# EAGLE design naomi_io (EAGLE 6.5.0)
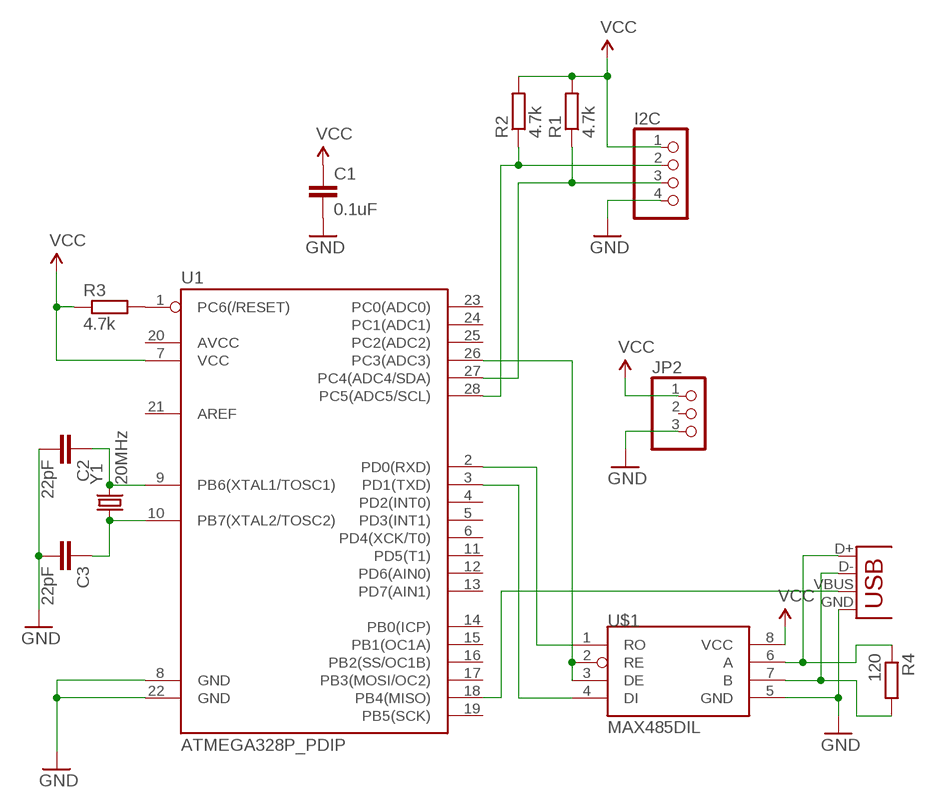
[diagram p0: schematic, sheet 1]

## Parts
C1  0.1uF  C-EU025-030X050  [C025-030X050]
C2  22pF  C-EU025-030X050  [C025-030X050]
C3  22pF  C-EU025-030X050  [C025-030X050]
I2C  PINHD-1X4/90  [1X04/90]
JP1  USB-B  USBPTH  [USB-B-PTH]
JP2  PINHD-1X3  [1X03]
R1  4.7k  R-EU_0204/5  [0204/5]
R2  4.7k  R-EU_0204/5  [0204/5]
R3  4.7k  R-EU_0204/5  [0204/5]
R4  120  R-EU_0204/5  [0204/5]
U1  ATMEGA328P_PDIP  [DIL28-3]
U$1  MAX485DIL  [DIL08]
Y1  20MHz  CRYSTALHC49US  [HC49US]

## Nets
GND: C1.2 C2.2 C3.2 I2C.4 JP1.GND JP2.3 U1.8(GND) U1.22(GND) U$1.5(GND)
N$1: I2C.2 R2.1 U1.28(PC5(ADC5/SCL))
N$2: I2C.3 R1.1 U1.27(PC4(ADC4/SDA))
N$3: R3.2 U1.1(PC6(/RESET))
N$5: JP1.D- R4.2 U$1.7(B)
N$6: U1.2(PD0(RXD)) U$1.1(RO)
N$7: U1.3(PD1(TXD)) U$1.4(DI)
N$8: JP1.VBUS U1.18(PB4(MISO))
N$9: U1.26(PC3(ADC3)) U$1.2(RE) U$1.3(DE)
N$10: C2.1 U1.9(PB6(XTAL1/TOSC1)) Y1.2
N$11: C3.1 U1.10(PB7(XTAL2/TOSC2)) Y1.1
N$12: JP1.D+ R4.1 U$1.6(A)
VCC: C1.1 I2C.1 JP2.1 R1.2 R2.2 R3.1 U1.7(VCC) U$1.8(VCC)
Unconnected: JP2.2 U1.4(PD2(INT0)) U1.5(PD3(INT1)) U1.6(PD4(XCK/T0)) U1.11(PD5(T1)) U1.12(PD6(AIN0)) U1.13(PD7(AIN1)) U1.14(PB0(ICP)) U1.15(PB1(OC1A)) U1.16(PB2(SS/OC1B)) U1.17(PB3(MOSI/OC2)) U1.19(PB5(SCK)) U1.20(AVCC) U1.21(AREF) U1.23(PC0(ADC0)) U1.24(PC1(ADC1)) U1.25(PC2(ADC2))

## Library data of the parts
C1-C3 = rcl:C-EU: CAPACITOR, European symbol
I2C = pinhead:PINHD-1X4: PIN HEADER
JP1 = SparkFun-Connectors:USB: USB Connectors USB-B-PTH is fully proven SKU : PRT-00139/CONN-08278 USB-miniB is fully proven SKU : PRT-00587 USB-A-PCB is untested. USB-A-H is throughly reviewed, but untested. Spark Fun Electronics SKU : PRT-00437 USB-B-SMT is throughly reviewed, but untested. Needs silkscreen touching up. USB-A-S has not been used/tested USB-MB-H has not been used/tested USB-MICROB has been used. CONN-09505; PROD_ID: CONN-08278
JP2 = pinhead:PINHD-1X3: PIN HEADER
R1-R4 = rcl:R-EU_: RESISTOR, European symbol
U1 = SparkFun-DigitalIC:ATMEGA328P_PDIP: uC used in the Arduino 32kb flash, 1k EEPROM, 2k SRAM This is the through-hole version of this chip.
U$1 = SparkFun-DigitalIC:MAX485: RS-485 transceiver
Y1 = SparkFun-FreqCtrl:CRYSTAL: Various standard crystals. Proven footprints. Spark Fun Electronics SKU : COM-00534

## Board
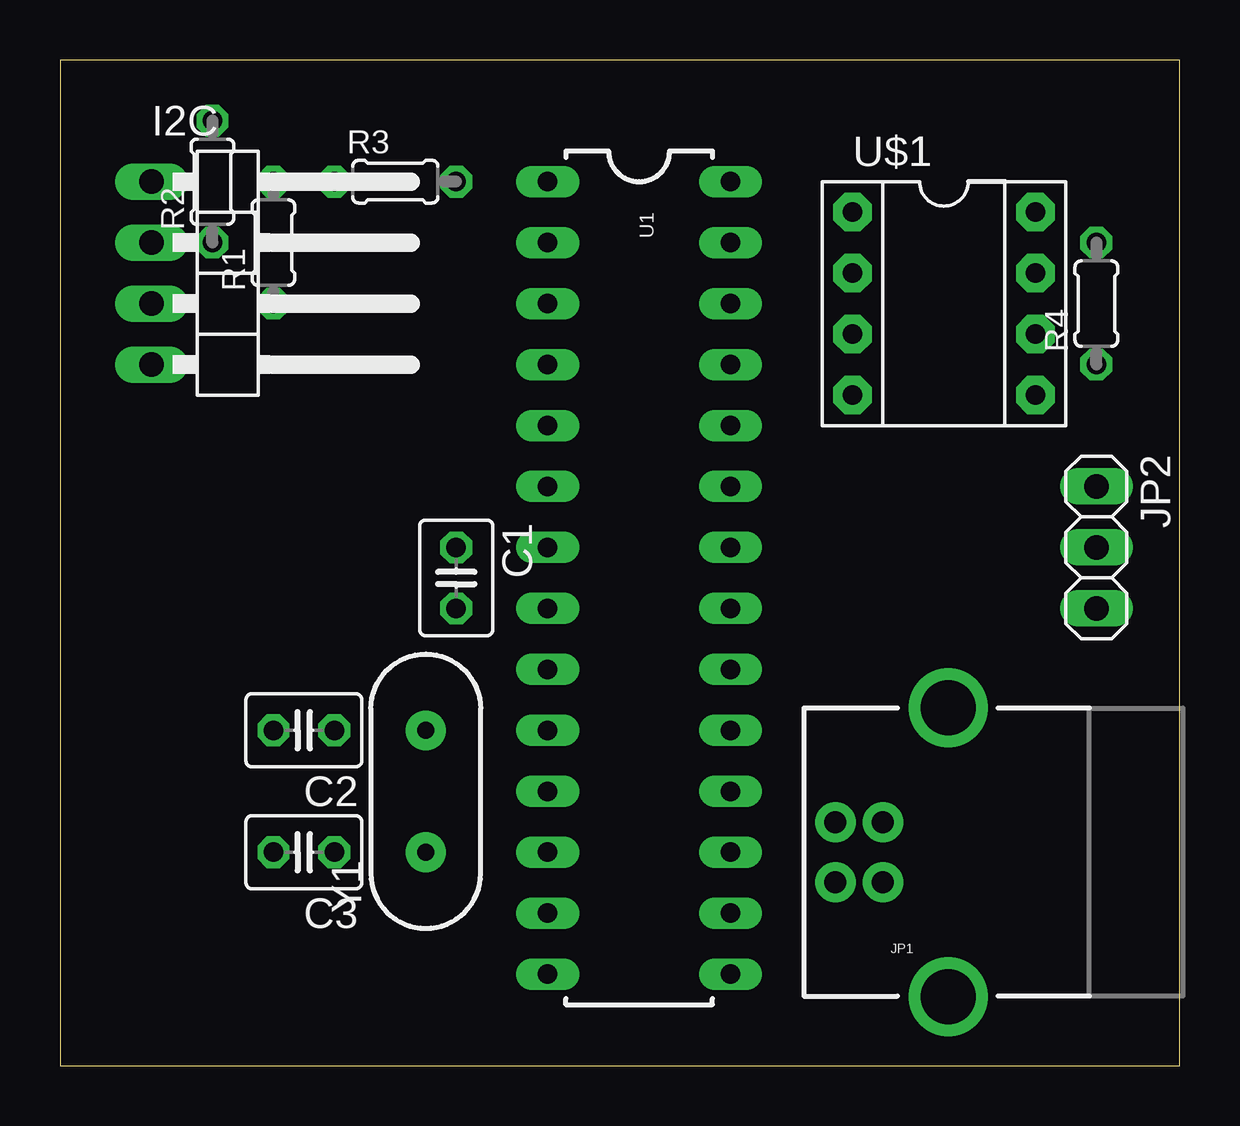
[diagram p1: board, top side]
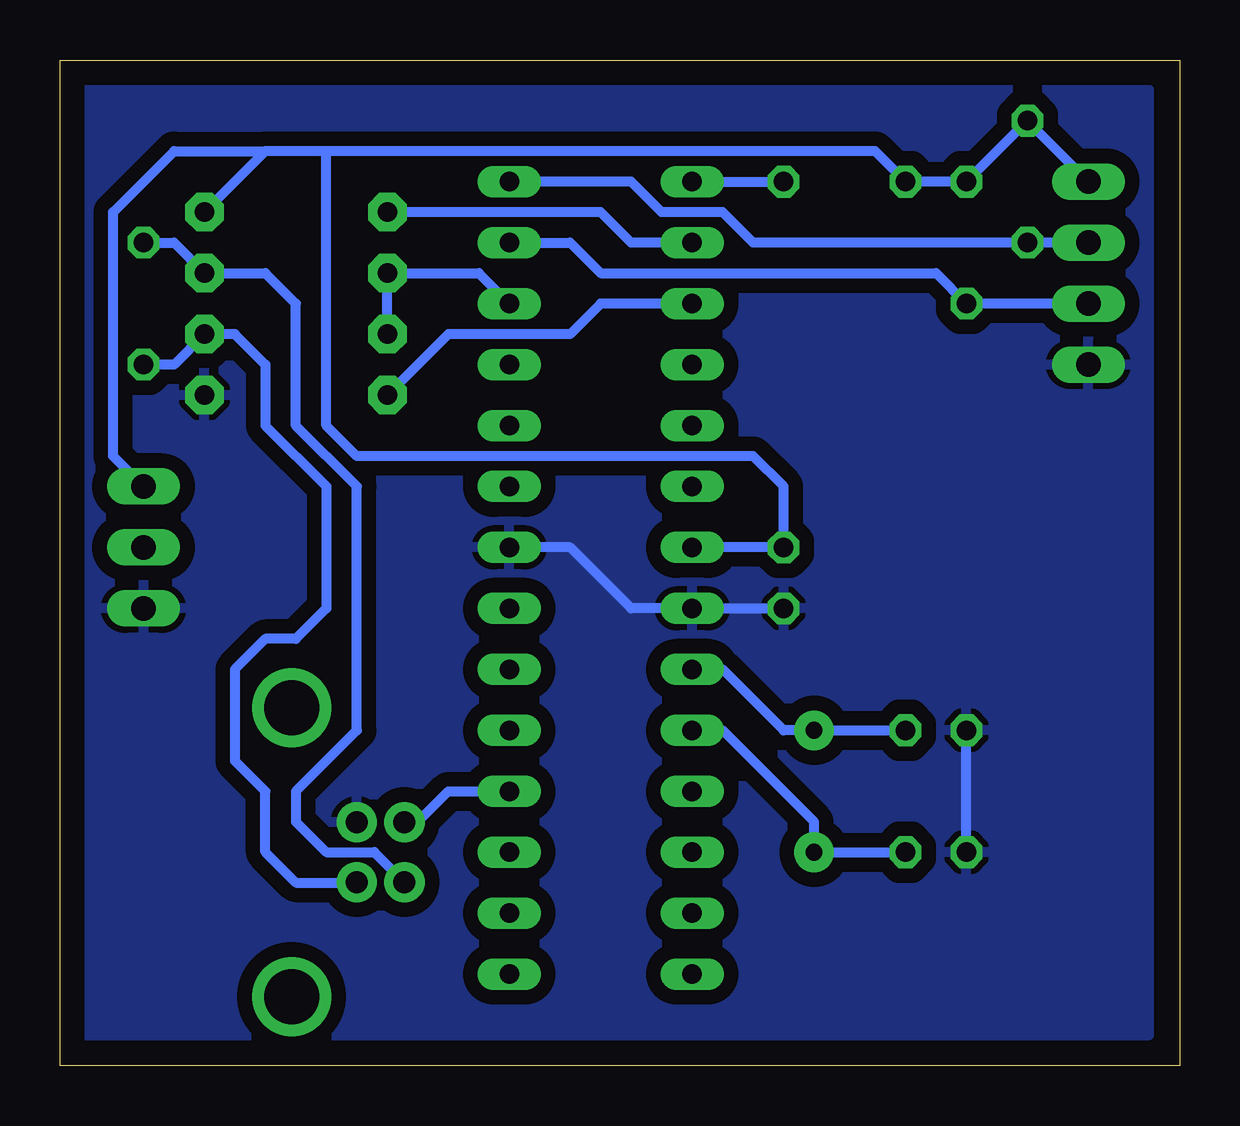
[diagram p2: board, bottom side, seen from below]

Size 46.66 x 41.9 mm. Coordinates in mm from the lower left corner, seen from the top.
Outline: 0,0 46.66,0 46.66,41.9 0,41.9 0,0
Copper layers (1*16): Top 0.035mm / dielectric 1.5mm / Bottom 0.035mm
Design rules "default": minimum track width 10mil, minimum drill 24mil, track to track 8mil, track to pad 8mil, pad to pad 8mil, via to via 8mil, smd to smd 8mil, copper to edge 40mil, drill to drill 8mil, minimum pad ring 10mil, minimum via ring 8mil, stop-mask expansion 4mil, vias tented up to drill 0mil, thermal gap 10mil

### Footprints (pad centres in the part's own frame; a part is rotated, then mirrored left to right if it is on the bottom)
C025-030X050 = drill 0.813 octagon: 1 -1.27,0; 2 1.27,0
1X04/90 = drill 1.016 long: 1 -3.81,-3.81; 2 -1.27,-3.81; 3 1.27,-3.81; 4 3.81,-3.81
USB-B-PTH = drill 0.914 pad 1.676: D+ 0,1.25; D- 1.981,1.25; GND 0,-1.25; VBUS 1.981,-1.25 | drill 2.286: S1 -2.718,-6.02; S2 -2.718,6.02
1X03 = drill 1.016 long: 1 -2.54,0; 2 0,0; 3 2.54,0
0204/5 = drill 0.813 octagon: 1 -2.54,0; 2 2.54,0
DIL28-3 = drill 0.813 long: 1 -16.51,-3.81; 2 -13.97,-3.81; 3 -11.43,-3.81; 4 -8.89,-3.81; 5 -6.35,-3.81; 6 -3.81,-3.81; 7 -1.27,-3.81; 8 1.27,-3.81; 9 3.81,-3.81; 10 6.35,-3.81; 11 8.89,-3.81; 12 11.43,-3.81; 13 13.97,-3.81; 14 16.51,-3.81; 15 16.51,3.81; 16 13.97,3.81; 17 11.43,3.81; 18 8.89,3.81; 19 6.35,3.81; 20 3.81,3.81; 21 1.27,3.81; 22 -1.27,3.81; 23 -3.81,3.81; 24 -6.35,3.81; 25 -8.89,3.81; 26 -11.43,3.81; 27 -13.97,3.81; 28 -16.51,3.81
DIL08 = drill 0.813 pad 1.6 octagon: 1 -3.81,-3.81; 2 -1.27,-3.81; 3 1.27,-3.81; 4 3.81,-3.81; 5 3.81,3.81; 6 1.27,3.81; 7 -1.27,3.81; 8 -3.81,3.81
HC49US = drill 0.7 pad 1.651: 1 -2.54,0; 2 2.54,0

### Placement (x,y rotation side)
C1  16.51,20.32 270 top
C2  10.16,13.97 180 top
C3  10.16,8.89 180 top
I2C  7.62,33.02 270 top
JP1  34.29,8.89 180 top
JP2  43.18,21.59 270 top
R1  8.89,34.29 90 top
R2  6.35,36.83 90 top
R3  13.97,36.83 0 top
R4  43.18,31.75 90 top
U1  24.13,20.32 270 top
U$1  36.83,31.75 270 top
Y1  15.24,11.43 90 top

### Tracks (layer width: path | path; a pad name or v marks a point on that pad's centre or on a via)
GND
  Bottom 0.406: C1.2 U1.8 22.86,19.05 25.4,21.59 U1.22 | C3.2 C2.2
  pour Bottom (isolate 0.61): 1.27,40.64 45.72,40.64 45.72,1.27 1.27,1.27
N$1
  Bottom 0.406: I2C.2 R2.1 17.78,34.29 19.05,35.56 21.59,35.56 22.86,36.83 U1.28
N$2
  Bottom 0.406: I2C.3 R1.1 10.16,33.02 24.13,33.02 25.4,34.29 U1.27
N$3
  Bottom 0.406: U1.1 R3.2
N$5
  Bottom 0.406: R4.2 41.91,34.29 U$1.7 38.1,33.02 36.83,31.75 36.83,26.67 34.29,24.13 34.29,13.97 36.83,11.43 36.83,10.16 35.56,8.89 33.56,8.89 JP1.D-
N$6
  Bottom 0.406: U1.2 22.86,34.29 24.13,35.56 U$1.1
N$7
  Bottom 0.406: U1.3 24.13,31.75 25.4,30.48 30.48,30.48 U$1.4
N$8
  Bottom 0.406: JP1.VBUS 31.77,10.14 30.48,11.43 U1.18
N$9
  Bottom 0.406: U$1.3 U$1.2 29.21,33.02 U1.26
N$10
  Bottom 0.406: C2.1 Y1.2 16.51,13.97 19.05,16.51 U1.9
N$11
  Bottom 0.406: C3.1 Y1.1 15.24,10.16 19.05,13.97 U1.10
N$12
  Bottom 0.406: R4.1 41.91,29.21 U$1.6 39.37,30.48 38.1,29.21 38.1,26.67 35.56,24.13 35.56,19.05 36.83,17.78 38.1,17.78 39.37,16.51 39.37,12.7 38.1,11.43 38.1,8.89 36.83,7.62 34.31,7.62 JP1.D+
VCC
  Bottom 0.406: I2C.1 R2.2 R1.2 R3.1 12.7,38.1 35.56,38.1 | U1.7 C1.1 16.51,24.13 17.78,25.4 34.29,25.4 35.56,26.67 35.56,38.1 | 35.56,38.1 38.1,38.1 | 38.1,38.1 U$1.8 | 38.1,38.1 41.91,38.1 44.45,35.56 44.45,25.4 JP2.1